# EAGLE board core (EAGLE 9.2.2), part 1 of 2
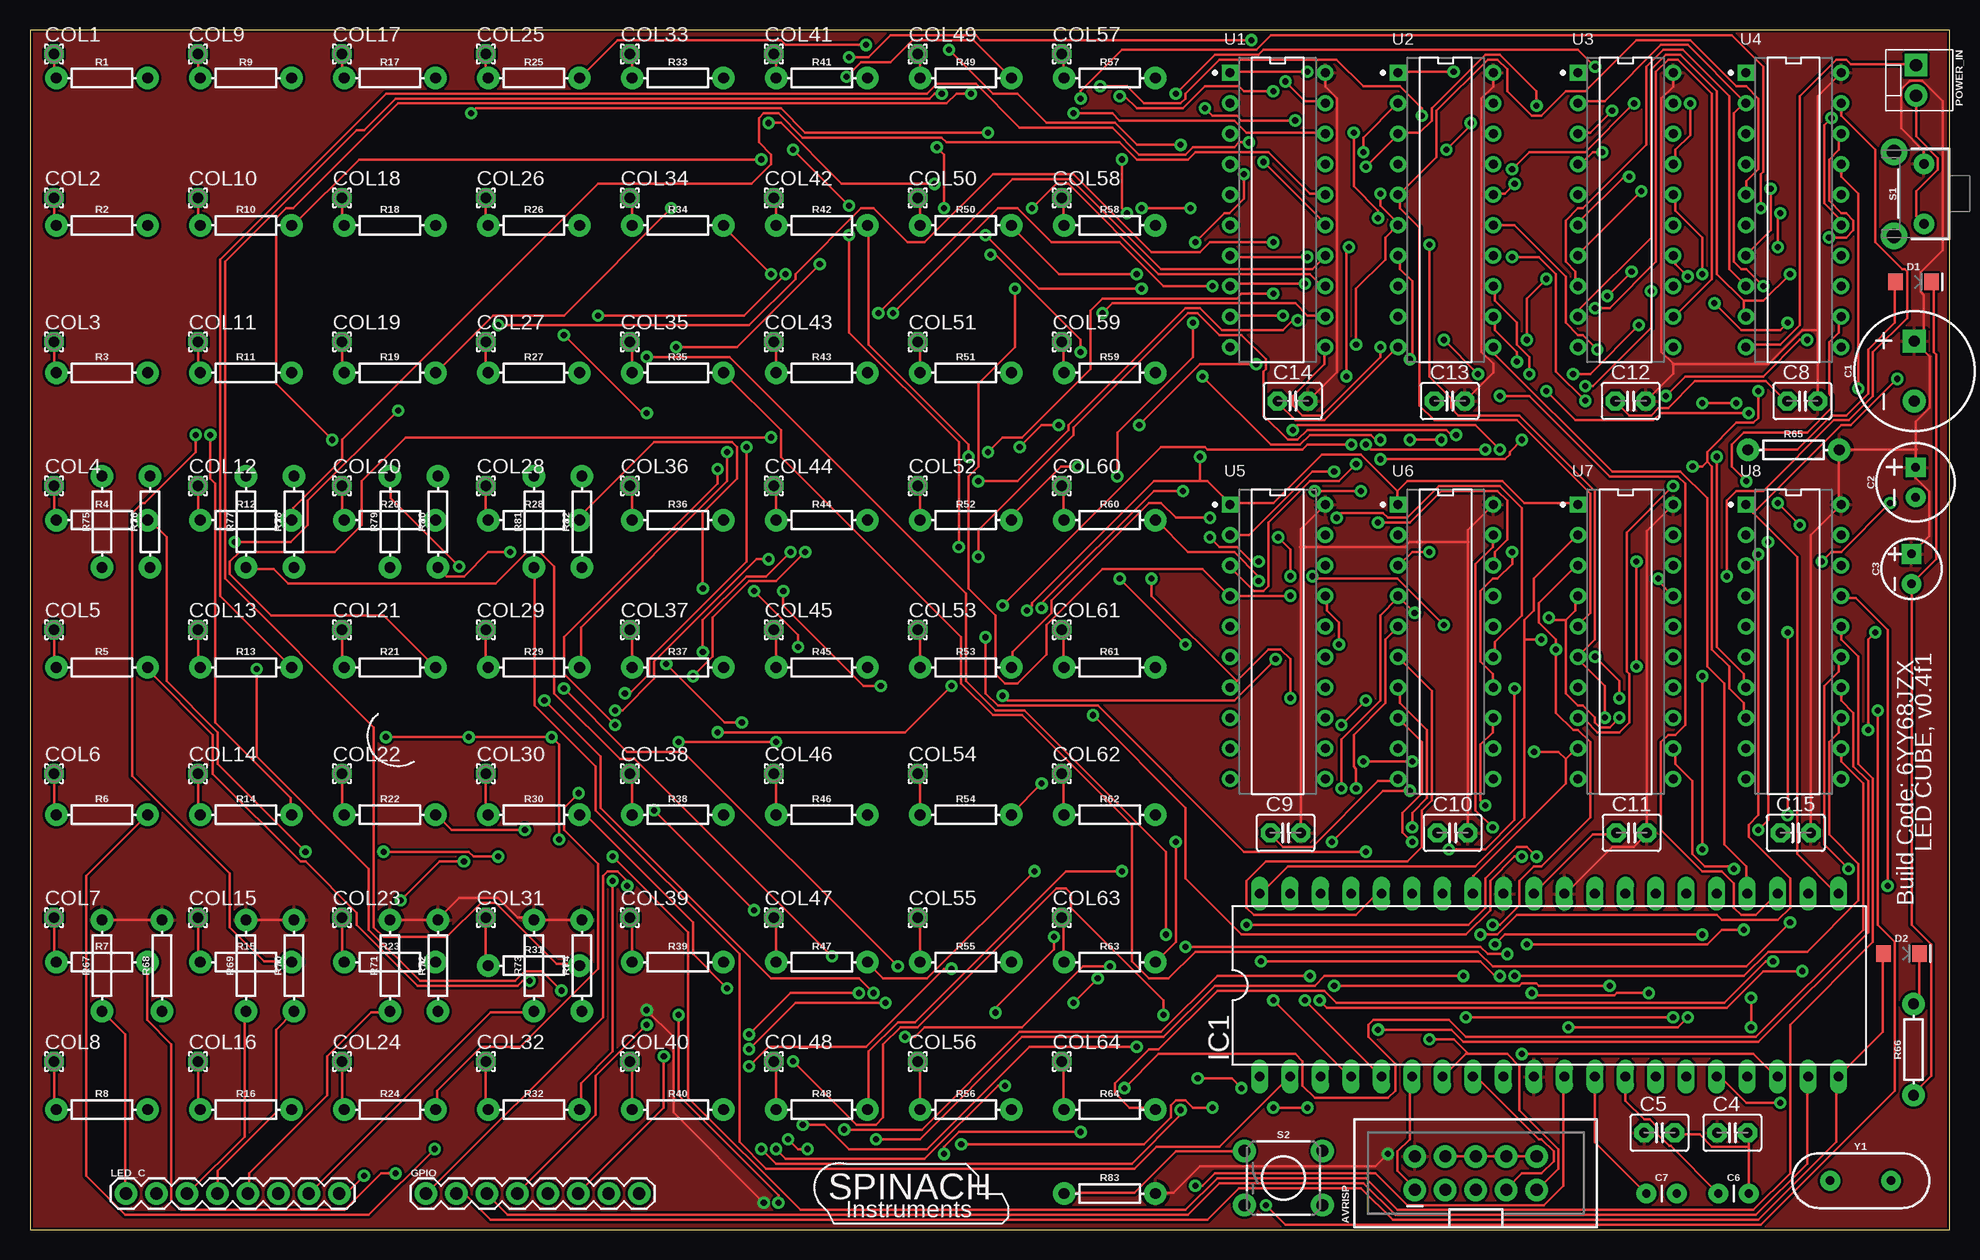
[diagram p1: board, top side]
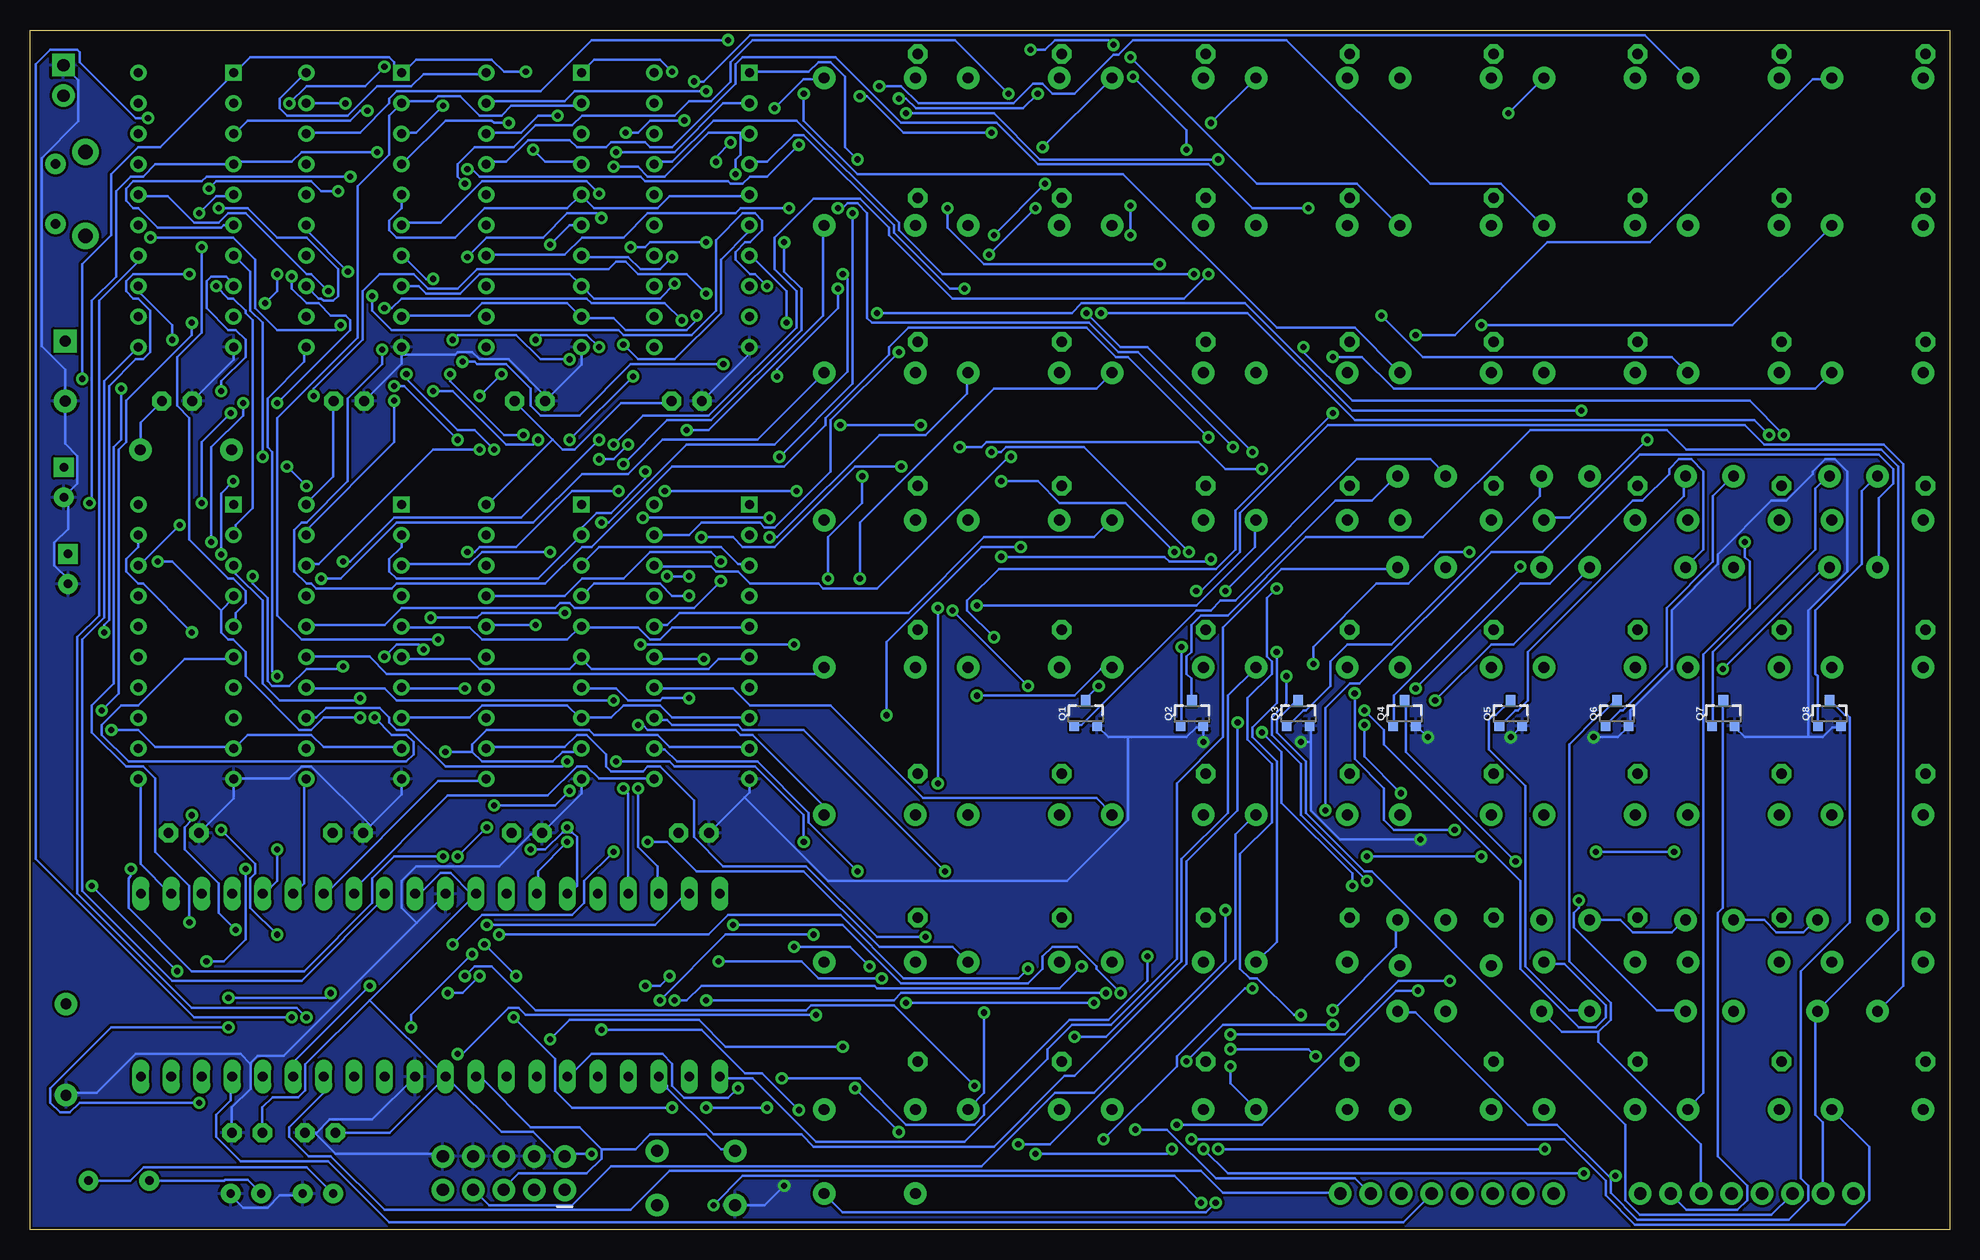
[diagram p2: board, bottom side, seen from below]

Size 160 x 100 mm. Coordinates in mm from the lower left corner, seen from the top.
Outline: 0,0 160,0 160,100 0,100 0,0
Copper layers (1*16): Top 0.035mm / dielectric 1.5mm / Bottom 0.035mm
Design rules "SparkFun": minimum track width 8mil, minimum drill 20mil, track to track 8mil, track to pad 8mil, pad to pad 8mil, via to via 8mil, smd to smd 8mil, copper to edge 8mil, drill to drill 8mil, minimum pad ring 12mil, minimum via ring 10mil, stop-mask expansion 4mil, vias tented up to drill 20mil, thermal gap 10mil

## Footprints (pad centres in the part's own frame; a part is rotated, then mirrored left to right if it is on the bottom)
2X5-SHROUDED_LOCK = drill 1.016 pad 1.88: 1 -1.397,5.08; 2 1.397,5.08; 3 -1.397,2.54; 4 1.397,2.54; 5 -1.397,0; 6 1.397,0; 7 -1.397,-2.54; 8 1.397,-2.54; 9 -1.397,-5.08; 10 1.397,-5.08
CPOL-RADIAL-5MM-10MM = drill 0.9 pad 1.93 square: + 2.5,0 | drill 0.9 pad 1.93: - -2.5,0
CPOL-RADIAL-2.5MM-6.5MM = drill 0.7 pad 1.651 square: 1 1.25,0 | drill 0.7 pad 1.651: 2 -1.25,0
CPOL-RADIAL-2.5MM-5MM = drill 0.7 pad 1.651 square: 1 1.25,0 | drill 0.7 pad 1.651: 2 -1.25,0
C2.5-3 = drill 0.813 pad 1.6 octagon: 1 -1.27,0; 2 1.27,0
CAP-PTH-2.54 = drill 0.7 pad 1.651: 1 -1.27,0; 2 1.27,0
1,6/0,9 = drill 0.914 pad 1.6 octagon: 1 0,0
LED-1206 = smd 1.2 x 1.4: A -1.5,0; C 1.5,0
1X08 = drill 1.016 pad 1.88: 1 0,0; 2 2.54,0; 3 5.08,0; 4 7.62,0; 5 10.16,0; 6 12.7,0; 7 15.24,0; 8 17.78,0
DIL40 = drill 0.813 long: 1 -24.13,-7.62; 2 -21.59,-7.62; 3 -19.05,-7.62; 4 -16.51,-7.62; 5 -13.97,-7.62; 6 -11.43,-7.62; 7 -8.89,-7.62; 8 -6.35,-7.62; 9 -3.81,-7.62; 10 -1.27,-7.62; 11 1.27,-7.62; 12 3.81,-7.62; 13 6.35,-7.62; 14 8.89,-7.62; 15 11.43,-7.62; 16 13.97,-7.62; 17 16.51,-7.62; 18 19.05,-7.62; 19 21.59,-7.62; 20 24.13,-7.62; 21 24.13,7.62; 22 21.59,7.62; 23 19.05,7.62; 24 16.51,7.62; 25 13.97,7.62; 26 11.43,7.62; 27 8.89,7.62; 28 6.35,7.62; 29 3.81,7.62; 30 1.27,7.62; 31 -1.27,7.62; 32 -3.81,7.62; 33 -6.35,7.62; 34 -8.89,7.62; 35 -11.43,7.62; 36 -13.97,7.62; 37 -16.51,7.62; 38 -19.05,7.62; 39 -21.59,7.62; 40 -24.13,7.62
MOLEX-1X2 = drill 1.016 pad 1.88 square: 1 0,0 | drill 1.016 pad 1.88: 2 2.54,0
SOT23-3 = smd 0.8 x 0.9: 1 -0.95,-1; 2 0.95,-1; 3 0,1.1
AXIAL-0.3 = drill 0.9 pad 1.88: P$1 -3.81,0; P$2 3.81,0
TACTILE_SWITCH_PTH_RIGHT_ANGLE_KIT = drill 0.8 pad 1.7: 1 -2.5,0; 2 2.5,0 | drill 1.2 pad 2.2: ANCHOR1 -3.5,2.5; ANCHOR2 3.5,2.5
TACTILE_SWITCH_PTH_6.0MM = drill 1.016 pad 1.88: 1 -3.251,2.261; 2 3.251,2.261; 3 -3.251,-2.261; 4 3.251,-2.261
TEXAS_INSTRUMENTS_SN74HC574N_0 = drill 0.75 pad 1.25 square: 1 -3.97,11.43 | drill 0.75 pad 1.25: 2 -3.97,8.89; 3 -3.97,6.35; 4 -3.97,3.81; 5 -3.97,1.27; 6 -3.97,-1.27; 7 -3.97,-3.81; 8 -3.97,-6.35; 9 -3.97,-8.89; 10 -3.97,-11.43; 11 3.97,-11.43; 12 3.97,-8.89; 13 3.97,-6.35; 14 3.97,-3.81; 15 3.97,-1.27; 16 3.97,1.27; 17 3.97,3.81; 18 3.97,6.35; 19 3.97,8.89; 20 3.97,11.43
HC49US = drill 0.7 pad 1.651: 1 -2.54,0; 2 2.54,0

## Placement (x,y rotation side)
AVRISP  AVR_SPI_PROG_5X2LOCK  [2X5-SHROUDED_LOCK]  120.51,4.7 90 top
C1  1mF  [CPOL-RADIAL-5MM-10MM]  157.07,71.56 90 top
C2  100uF  [CPOL-RADIAL-2.5MM-6.5MM]  157.18,62.29 90 top
C3  10uF  [CPOL-RADIAL-2.5MM-5MM]  156.83,55.07 90 top
C4  1uF  [C2.5-3]  141.9,8.07 0 top
C5  1uF  [C2.5-3]  135.82,8.07 0 top
C6  22pF  [CAP-PTH-2.54]  142,3 0 top
C7  22pF  [CAP-PTH-2.54]  136,3 0 top
C8  1uF  [C2.5-3]  147.74,69.07 0 top
C9  1uF  [C2.5-3]  104.66,33.07 0 top
C10  1uF  [C2.5-3]  118.58,33.07 0 top
C11  1uF  [C2.5-3]  133.5,33.07 0 top
C12  1uF  [C2.5-3]  133.42,69.07 0 top
C13  1uF  [C2.5-3]  118.34,69.07 0 top
C14  1uF  [C2.5-3]  105.26,69.07 0 top
C15  1uF  [C2.5-3]  147.18,33.07 0 top
COL1  [1,6/0,9]  2,98 0 top
COL2  [1,6/0,9]  2,86 0 top
COL3  [1,6/0,9]  2,74 0 top
COL4  [1,6/0,9]  2,62 0 top
COL5  [1,6/0,9]  2,50 0 top
COL6  [1,6/0,9]  2,38 0 top
COL7  [1,6/0,9]  2,26 0 top
COL8  [1,6/0,9]  2,14 0 top
COL9  [1,6/0,9]  14,98 0 top
COL10  [1,6/0,9]  14,86 0 top
COL11  [1,6/0,9]  14,74 0 top
COL12  [1,6/0,9]  14,62 0 top
COL13  [1,6/0,9]  14,50 0 top
COL14  [1,6/0,9]  14,38 0 top
COL15  [1,6/0,9]  14,26 0 top
COL16  [1,6/0,9]  14,14 0 top
COL17  [1,6/0,9]  26,98 0 top
COL18  [1,6/0,9]  26,86 0 top
COL19  [1,6/0,9]  26,74 0 top
COL20  [1,6/0,9]  26,62 0 top
COL21  [1,6/0,9]  26,50 0 top
COL22  [1,6/0,9]  26,38 0 top
COL23  [1,6/0,9]  26,26 0 top
COL24  [1,6/0,9]  26,14 0 top
COL25  [1,6/0,9]  38,98 0 top
COL26  [1,6/0,9]  38,86 0 top
COL27  [1,6/0,9]  38,74 0 top
COL28  [1,6/0,9]  38,62 0 top
COL29  [1,6/0,9]  38,50 0 top
COL30  [1,6/0,9]  38,38 0 top
COL31  [1,6/0,9]  38,26 0 top
COL32  [1,6/0,9]  38,14 0 top
COL33  [1,6/0,9]  50,98 0 top
COL34  [1,6/0,9]  50,86 0 top
COL35  [1,6/0,9]  50,74 0 top
COL36  [1,6/0,9]  50,62 0 top
COL37  [1,6/0,9]  50,50 0 top
COL38  [1,6/0,9]  50,38 0 top
COL39  [1,6/0,9]  50,26 0 top
COL40  [1,6/0,9]  50,14 0 top
COL41  [1,6/0,9]  62,98 0 top
COL42  [1,6/0,9]  62,86 0 top
COL43  [1,6/0,9]  62,74 0 top
COL44  [1,6/0,9]  62,62 0 top
COL45  [1,6/0,9]  62,50 0 top
COL46  [1,6/0,9]  62,38 0 top
COL47  [1,6/0,9]  62,26 0 top
COL48  [1,6/0,9]  62,14 0 top
COL49  [1,6/0,9]  74,98 0 top
COL50  [1,6/0,9]  74,86 0 top
COL51  [1,6/0,9]  74,74 0 top
COL52  [1,6/0,9]  74,62 0 top
COL53  [1,6/0,9]  74,50 0 top
COL54  [1,6/0,9]  74,38 0 top
COL55  [1,6/0,9]  74,26 0 top
COL56  [1,6/0,9]  74,14 0 top
COL57  [1,6/0,9]  86,98 0 top
COL58  [1,6/0,9]  86,86 0 top
COL59  [1,6/0,9]  86,74 0 top
COL60  [1,6/0,9]  86,62 0 top
COL61  [1,6/0,9]  86,50 0 top
COL62  [1,6/0,9]  86,38 0 top
COL63  [1,6/0,9]  86,26 0 top
COL64  [1,6/0,9]  86,14 0 top
D1  Yellow  [LED-1206]  157,79 0 top
D2  Yellow  [LED-1206]  156,23 0 top
GPIO  [1X08]  33,3 0 top
IC1  MEGA32-P  [DIL40]  126.63,20.37 0 top
LED_C  [1X08]  8,3 0 top
POWER_IN  [MOLEX-1X2]  157.21,97.07 270 top
Q1  1.2A/40V  [SOT23-3]  72,43 0 bottom
Q2  1.2A/40V  [SOT23-3]  63.14,43 0 bottom
Q3  1.2A/40V  [SOT23-3]  54.29,43 0 bottom
Q4  1.2A/40V  [SOT23-3]  45.43,43 0 bottom
Q5  1.2A/40V  [SOT23-3]  36.57,43 0 bottom
Q6  1.2A/40V  [SOT23-3]  27.71,43 0 bottom
Q7  1.2A/40V  [SOT23-3]  18.86,43 0 bottom
Q8  1.2A/40V  [SOT23-3]  10,43 0 bottom
R1  100  [AXIAL-0.3]  6,96 0 top
R2  100  [AXIAL-0.3]  6,83.71 0 top
R3  100  [AXIAL-0.3]  6,71.43 0 top
R4  100  [AXIAL-0.3]  6,59.14 0 top
R5  100  [AXIAL-0.3]  6,46.86 0 top
R6  100  [AXIAL-0.3]  6,34.57 0 top
R7  100  [AXIAL-0.3]  6,22.29 0 top
R8  100  [AXIAL-0.3]  6,10 0 top
R9  100  [AXIAL-0.3]  18,96 0 top
R10  100  [AXIAL-0.3]  18,83.71 0 top
R11  100  [AXIAL-0.3]  18,71.43 0 top
R12  100  [AXIAL-0.3]  18,59.14 0 top
R13  100  [AXIAL-0.3]  18,46.86 0 top
R14  100  [AXIAL-0.3]  18,34.57 0 top
R15  100  [AXIAL-0.3]  18,22.29 0 top
R16  100  [AXIAL-0.3]  18,10 0 top
R17  100  [AXIAL-0.3]  30,96 0 top
R18  100  [AXIAL-0.3]  30,83.71 0 top
R19  100  [AXIAL-0.3]  30,71.43 0 top
R20  100  [AXIAL-0.3]  30,59.14 0 top
R21  100  [AXIAL-0.3]  30,46.86 0 top
R22  100  [AXIAL-0.3]  30,34.57 0 top
R23  100  [AXIAL-0.3]  30,22.29 0 top
R24  100  [AXIAL-0.3]  30,10 0 top
R25  100  [AXIAL-0.3]  42,96 0 top
R26  100  [AXIAL-0.3]  42,83.71 0 top
R27  100  [AXIAL-0.3]  42,71.43 0 top
R28  100  [AXIAL-0.3]  42,59.14 0 top
R29  100  [AXIAL-0.3]  42,46.86 0 top
R30  100  [AXIAL-0.3]  42,34.57 0 top
R31  100  [AXIAL-0.3]  42,22 0 top
R32  100  [AXIAL-0.3]  42,10 0 top
R33  100  [AXIAL-0.3]  54,96 0 top
R34  100  [AXIAL-0.3]  54,83.71 0 top
R35  100  [AXIAL-0.3]  54,71.43 0 top
R36  100  [AXIAL-0.3]  54,59.14 0 top
R37  100  [AXIAL-0.3]  54,46.86 0 top
R38  100  [AXIAL-0.3]  54,34.57 0 top
R39  100  [AXIAL-0.3]  54,22.29 0 top
R40  100  [AXIAL-0.3]  54,10 0 top
R41  100  [AXIAL-0.3]  66,96 0 top
R42  100  [AXIAL-0.3]  66,83.71 0 top
R43  100  [AXIAL-0.3]  66,71.43 0 top
R44  100  [AXIAL-0.3]  66,59.14 0 top
R45  100  [AXIAL-0.3]  66,46.86 0 top
R46  100  [AXIAL-0.3]  66,34.57 0 top
R47  100  [AXIAL-0.3]  66,22.29 0 top
R48  100  [AXIAL-0.3]  66,10 0 top
R49  100  [AXIAL-0.3]  78,96 0 top
R50  100  [AXIAL-0.3]  78,83.71 0 top
R51  100  [AXIAL-0.3]  78,71.43 0 top
R52  100  [AXIAL-0.3]  78,59.14 0 top
R53  100  [AXIAL-0.3]  78,46.86 0 top
R54  100  [AXIAL-0.3]  78,34.57 0 top
R55  100  [AXIAL-0.3]  78,22.29 0 top
R56  100  [AXIAL-0.3]  78,10 0 top
R57  100  [AXIAL-0.3]  90,96 0 top
R58  100  [AXIAL-0.3]  90,83.71 0 top
R59  100  [AXIAL-0.3]  90,71.43 0 top
R60  100  [AXIAL-0.3]  90,59.14 0 top
R61  100  [AXIAL-0.3]  90,46.86 0 top
R62  100  [AXIAL-0.3]  90,34.57 0 top
R63  100  [AXIAL-0.3]  90,22.29 0 top
R64  100  [AXIAL-0.3]  90,10 0 top
R65  100  [AXIAL-0.3]  147,65 0 top
R66  100  [AXIAL-0.3]  157,15 90 top
R67  4.7k  [AXIAL-0.3]  6,22 90 top
R68  4.7k  [AXIAL-0.3]  11,22 90 top
R69  4.7k  [AXIAL-0.3]  18,22 90 top
R70  4.7k  [AXIAL-0.3]  22,22 90 top
R71  4.7k  [AXIAL-0.3]  30,22 90 top
R72  4.7k  [AXIAL-0.3]  34,22 90 top
R73  4.7k  [AXIAL-0.3]  42,22 90 top
R74  4.7k  [AXIAL-0.3]  46,22 90 top
R75  4.7k  [AXIAL-0.3]  6,59 90 top
R76  4.7k  [AXIAL-0.3]  10,59 90 top
R77  4.7k  [AXIAL-0.3]  18,59 90 top
R78  4.7k  [AXIAL-0.3]  22,59 90 top
R79  4.7k  [AXIAL-0.3]  30,59 90 top
R80  4.7k  [AXIAL-0.3]  34,59 90 top
R81  4.7k  [AXIAL-0.3]  42,59 90 top
R82  4.7k  [AXIAL-0.3]  46,59 90 top
R83  4.7k  [AXIAL-0.3]  90,3 0 top
S1  MOMENTARY-SWITCH-SPST-PTH-RIGHT-ANGLE-KIT  [TACTILE_SWITCH_PTH_RIGHT_ANGLE_KIT]  157.87,86.34 90 top
S2  MOMENTARY-SWITCH-SPST-PTH-6.0MM  [TACTILE_SWITCH_PTH_6.0MM]  104.48,4.29 0 top
U1  TEXAS_INSTRUMENTS_SN74HC574NTEXAS_INSTRUMENTS_SN74HC574N_0_0  [TEXAS_INSTRUMENTS_SN74HC574N_0]  104,85 0 top
U2  TEXAS_INSTRUMENTS_SN74HC574NTEXAS_INSTRUMENTS_SN74HC574N_0_0  [TEXAS_INSTRUMENTS_SN74HC574N_0]  118,85 0 top
U3  TEXAS_INSTRUMENTS_SN74HC574NTEXAS_INSTRUMENTS_SN74HC574N_0_0  [TEXAS_INSTRUMENTS_SN74HC574N_0]  133,85 0 top
U4  TEXAS_INSTRUMENTS_SN74HC574NTEXAS_INSTRUMENTS_SN74HC574N_0_0  [TEXAS_INSTRUMENTS_SN74HC574N_0]  147,85 0 top
U5  TEXAS_INSTRUMENTS_SN74HC574NTEXAS_INSTRUMENTS_SN74HC574N_0_0  [TEXAS_INSTRUMENTS_SN74HC574N_0]  104,49 0 top
U6  TEXAS_INSTRUMENTS_SN74HC574NTEXAS_INSTRUMENTS_SN74HC574N_0_0  [TEXAS_INSTRUMENTS_SN74HC574N_0]  118,49 0 top
U7  TEXAS_INSTRUMENTS_SN74HC574NTEXAS_INSTRUMENTS_SN74HC574N_0_0  [TEXAS_INSTRUMENTS_SN74HC574N_0]  133,49 0 top
U8  TEXAS_INSTRUMENTS_SN74HC574NTEXAS_INSTRUMENTS_SN74HC574N_0_0  [TEXAS_INSTRUMENTS_SN74HC574N_0]  147,49 0 top
Y1  16MHz  [HC49US]  152.59,4.07 0 top

## Tracks (layer width: path | path; a pad name or v marks a point on that pad's centre or on a via)
CLK1
  Bottom 0.203: U4.11 150.98,73.56 153.82,70.71 153.82,51 155.65,49.17 155.65,28.25 148.13,20.73 137.36,20.73 130.25,27.84 IC1.29
CLK2
  Bottom 0.203: U5.11 108.1,37.59 112.57,37.59 113.59,38.61 114.4,38.61 116.84,36.17 125.17,36.17 132.89,28.45 132.89,28.04 IC1.28
CLK3
  Bottom 0.203: U6.11 122.12,37.39 125.98,37.39 135.33,28.04 IC1.27
CLK4
  Bottom 0.203: U7.11 137.16,37.39 137.16,28.85 137.97,28.04 IC1.26
CLK5  (via drill 0.51)
  Top 0.203: v139.4,31.7 v139.4,46.13
  Bottom 0.203: v139.4,46.13 139.8,46.53 139.8,64.82 140.21,65.23 140.21,69.29 137.16,72.34 137.16,73.56 U3.11 | v139.4,31.7 139.4,29.06 140.41,28.04 IC1.25
CLK6
  Top 0.203: U2.11 122.12,73.56 122.12,72.95 131.88,63.2 137.57,63.2 139.8,60.96 139.8,46.94 141.22,45.52 141.22,32.11 143.05,30.28 143.05,28.04 IC1.24
CLK7  (via drill 0.51)
  Top 0.203: v112.57,73.56 112.57,72.75 107.7,67.87 106.07,67.87 105.26,68.68 105.26,69.49 107.9,72.14 107.9,73.56 U1.11 | v120.7,71.32 v117.86,74.17 | v122.53,69.49 124.97,69.49 131.67,62.79 137.36,62.79 137.97,62.18 137.97,42.06 137.16,41.25 136.55,41.25 135.94,40.64 135.94,33.33 139.4,29.87 141.02,29.87 142.04,28.85 142.04,26.82 142.65,26.21 143.87,26.21 145.49,27.84 IC1.23
  Bottom 0.203: v112.57,73.56 113.59,74.57 117.45,74.57 v117.86,74.17 | v122.53,69.49 v120.7,71.32
CLK8
  Bottom 0.203: U8.11 150.77,37.39 150.77,30.48 148.34,28.04 IC1.22
D0  (via drill 0.51)
  Top 0.203: v108.71,63.2 106.88,63.2 101.6,57.91 100.18,57.91 U5.2 | 124.56,49.17 124.56,50.8 125.37,51.61 125.37,54.25 128.83,57.71 U7.2 | 124.56,49.17 124.56,34.34 120.5,30.28 104.85,30.28 102.62,28.04 IC1.40 | v111.15,89.81 111.15,91.03 114,93.88 U2.2 | v144.47,78.64 143.05,80.06 142.65,80.06 142.04,80.67 142.04,93.07 142.85,93.88 U4.2 142.85,94.08 138.18,98.75 135.94,98.75 131.27,94.08 129.03,94.08 U3.2 | v125.98,49.17 124.56,49.17
  Bottom 0.203: v108.71,63.2 108.71,62.59 111.56,59.74 112.78,59.74 114,58.52 114,57.91 U6.2 114.2,57.71 117.65,54.25 129.44,54.25 130.05,54.86 130.05,55.88 129.03,56.9 129.03,57.71 U7.2 | v111.15,89.81 106.27,89.81 102.21,93.88 100.18,93.88 U1.2 | U2.2 114.2,93.88 114.4,93.67 119.89,93.67 120.7,92.86 122.53,92.86 124.16,94.49 125.98,94.49 126.39,94.08 128.83,94.08 U3.2 129.03,93.88 130.05,92.86 130.05,89.61 132.69,86.97 132.69,74.37 139.4,67.67 139.4,51.21 137.36,49.17 v125.98,49.17 | v144.47,78.64 143.46,77.62 143.05,77.62 142.04,76.61 142.04,76.4 141.43,75.79 141.43,60.15 142.85,58.73 142.85,57.91 U8.2
D1  (via drill 0.51)
  Top 0.203: v131.88,93.27 130.05,91.44 129.03,91.44 U3.3 | v111.35,88.59 114,91.24 U2.3 114.2,91.44 115.82,91.44 116.84,92.46 116.84,93.47 121.31,97.94 122.53,97.94 125.58,94.89 v125.58,93.67 | v116.64,56.49 115.21,56.49 114.2,55.47 U6.3 | v132.49,44.3 132.49,45.72 v130.45,47.75 | U7.3 128.83,55.27 125.78,52.22 125.78,50.6 127.2,49.17 v127.2,48.36 127.2,43.08 128.63,41.66 129.03,41.66 130.05,40.64 130.05,34.34 125.98,30.28 125.37,30.28 124.16,29.06 124.16,27.03 122.53,25.4 v121.92,25.4 | v101.19,87.99 101.19,85.95 99.97,84.73 99.57,84.73 v97.13,82.3 | v110.54,63.8 109.12,62.38 106.68,62.38 103.23,58.93 103.23,53.65 102.82,53.24 102.01,53.24 99.97,55.27 U5.3
  Bottom 0.203: v131.88,93.27 132.49,93.27 133.3,92.46 141.83,92.46 142.85,91.44 U4.3 | 100.79,91.44 103.43,91.44 107.09,87.78 108.51,87.78 109.32,88.59 v111.35,88.59 | 100.79,91.44 100.18,91.44 U1.3 | v125.58,93.67 127.81,91.44 128.83,91.44 U3.3 | U5.3 100.18,55.47 100.99,55.47 102.41,56.9 112.57,56.9 114,55.47 U6.3 | v116.64,56.49 122.33,56.49 123.34,55.47 128.83,55.47 U7.3 | v132.49,44.3 132.69,44.09 139.19,44.09 140.61,45.52 140.61,52.43 142.85,54.66 142.85,55.27 U8.3 | v130.45,47.75 129.44,48.77 127.61,48.77 v127.2,48.36 | v121.92,25.4 107.9,25.4 105.46,27.84 105.05,27.84 IC1.39 | 100.79,91.44 100.79,89.61 101.19,89.2 v101.19,87.99 | v97.13,82.3 97.13,79.86 95.71,78.44 95.71,74.98 103.23,67.46 106.88,67.46 v110.54,63.8
D2  (via drill 0.51)
  Top 0.203: v118.06,90.02 120.09,92.05 v120.09,92.25 | v131.06,89.81 130.25,89.81 129.44,89 129.03,89 U3.4 | 128.02,50.8 128.83,51.61 128.83,52.63 U7.4 | 128.02,50.8 128.02,44.7 129.03,43.69 129.44,43.69 130.45,42.67 130.45,42.27 130.86,41.86 131.67,41.86 v132.49,42.67 | v105.05,52.83 100.18,52.83 U5.4 99.97,52.83 97.74,55.07 89.41,55.07 84.73,50.39 84.73,47.95 82.3,45.52 81.28,45.52 80.47,46.33 80.47,51.21 78.23,53.44 78.23,62.79 79.05,63.6 79.05,70.51 82.09,73.56 v82.09,78.44 | v109.32,36.78 109.32,40.84 112.57,44.09 112.57,51.21 114,52.63 U6.4 114.2,52.63 v115.42,51.41 | 128.02,50.8 126.8,50.8 v126.59,51 | v155.04,60.55 150.98,56.49 150.16,56.49 v149.35,55.68
  Bottom 0.203: v118.06,90.02 117.04,89 114.2,89 U2.4 | v120.09,92.25 121.31,92.25 121.51,92.46 125.37,92.46 128.83,89 U3.4 | v131.06,89.81 137.36,89.81 138.18,89 142.85,89 U4.4 143.05,88.8 149.56,88.8 150.57,87.78 151.59,87.78 152.81,86.56 152.81,79.45 154.84,77.42 154.84,60.76 v155.04,60.55 | v132.49,42.67 135.53,42.67 136.55,41.66 137.57,41.66 142.04,46.13 142.04,48.16 143.05,49.17 143.46,49.17 144.07,49.78 144.07,51.61 | 144.07,51.61 143.05,52.63 U8.4 | v105.05,52.83 106.48,52.83 107.49,53.85 112.98,53.85 114,52.83 U6.4 | v82.09,78.44 83.31,78.44 87.99,83.11 87.99,83.72 95.5,91.24 96.32,91.24 98.55,89 99.97,89 U1.4 | v109.32,36.78 109.32,31.9 107.7,30.28 107.7,28.04 IC1.38 | v126.59,51 122.73,51 122.33,51.41 v115.42,51.41 | v149.35,55.68 148.13,55.68 144.07,51.61
D3  (via drill 0.51)
  Top 0.203: v145.69,81.89 145.69,84.53 v145.9,84.73 | v110.54,36.78 110.54,38.41 110.34,38.61 110.34,41.25 112.98,43.89 112.98,49.17 114,50.19 U6.5 | U7.5 129.03,50.39 130.05,51.41 130.05,61.37 123.95,67.46 117.04,67.46 115.82,68.68 115.82,83.52 114.2,85.14 114.2,86.16 U2.5 114.2,86.36 117.25,89.41 117.25,93.27 121.51,97.54 122.33,97.54 123.14,96.72 123.14,94.89 125.17,92.86 125.98,92.86 128.02,94.89 129.64,94.89 133.91,99.16 138.38,99.16 142.24,95.3 143.05,95.3 144.07,94.28 144.07,88.39 143.05,87.38 143.05,86.36 U4.5
  Bottom 0.203: v145.69,81.89 145.69,74.78 147.73,72.75 147.73,68.68 146.71,67.67 146.71,57.51 143.46,54.25 143.05,54.25 142.04,53.24 142.04,52.22 142.85,51.41 142.85,50.39 U8.5 | v145.9,84.73 144.47,86.16 143.05,86.16 U4.5 | U1.5 100.18,86.16 106.68,86.16 107.7,85.14 112.98,85.14 114,86.16 U2.5 114.2,86.16 115.21,85.14 122.12,85.14 124.56,82.7 129.44,82.7 130.05,83.31 130.05,84.12 129.03,85.14 129.03,86.16 U3.5 | U5.5 100.18,50.19 106.48,50.19 107.49,49.17 108.31,49.17 109.32,50.19 114,50.19 U6.5 114.2,50.19 115.21,49.17 122.33,49.17 123.34,50.19 128.83,50.19 U7.5 | v110.54,36.78 110.13,36.37 110.13,28.04 IC1.37
D4  (via drill 0.51)
  Top 0.203: v110.54,73.76 110.54,78.44 112.98,80.87 112.98,82.7 114,83.72 U2.6 114,83.92 112.57,85.34 v112.57,86.36 | v133.3,87.78 132.89,87.78 129.03,83.92 U3.6 | v131.27,42.67 131.27,45.31 129.03,47.55 U7.6 129.03,47.75 130.45,49.17 130.45,61.57 124.16,67.87 119.08,67.87 118.47,68.48 118.47,69.29 116.64,71.12 v116.64,82.09 | IC1.36 112.57,27.84 112.17,27.84 110.54,26.21 102.01,26.21 101.4,26.82 101.4,29.06 103.02,30.68 114.81,30.68 116.03,31.9 116.03,34.95 116.84,35.76 116.84,44.91 114.2,47.55 U6.6
  Bottom 0.203: v110.54,73.76 109.32,72.54 106.27,72.54 102.41,76.4 102.41,80.87 100.18,83.11 100.18,83.72 U1.6 | v112.57,86.36 113.59,87.38 122.33,87.38 125.78,83.92 128.83,83.92 U3.6 | v133.3,87.78 145.29,87.78 145.69,87.38 151.38,87.38 151.99,86.77 151.99,85.75 151.38,85.14 150.98,85.14 149.35,83.52 144.07,83.52 143.87,83.72 143.05,83.72 U4.6 | U5.6 100.18,47.55 102.62,47.55 103.43,46.74 113.18,46.74 114,47.55 U6.6 114.2,47.55 115.01,46.74 122.53,46.74 123.34,47.55 128.83,47.55 U7.6 | v131.27,42.67 129.84,41.25 128.63,41.25 128.02,40.64 128.02,39.62 128.63,39.01 151.79,39.01 154.03,41.25 154.03,42.06 152.4,43.69 150.98,43.69 147.12,47.55 143.05,47.55 U8.6 | v116.64,82.09 115.01,83.72 114.2,83.72 U2.6
D5  (via drill 0.51)
  Top 0.203: 100.58,45.72 103.23,48.36 104.24,48.36 105.05,47.55 v105.05,44.3 | 100.58,45.72 100.18,45.31 U5.7 | v123.75,45.11 123.75,34.14 121.31,31.7 v118.26,31.7 | v115.21,33.53 115.21,34.75 116.43,35.97 116.43,41.66 114.2,43.89 114.2,45.11 U6.7 | v106.48,81.08 100.18,81.08 U1.7 | v140.61,64.41 140.61,48.56 142.85,46.33 142.85,45.31 U8.7 | v134.31,86.56 129.03,81.28 U3.7 | v145.09,86.77 145.09,83.31 143.05,81.28 U4.7 | v115.01,72.54 115.21,72.75 115.21,79.05 114.2,80.06 114.2,81.08 U2.7 | v124.77,74.17 124.77,77.62 v126.39,79.25 | 100.58,45.72 93.47,52.83 v93.47,54.25 | v90.63,62.79 90.63,66.45 96.93,72.75 v96.93,75.59
  Bottom 0.203: v105.05,44.3 107.29,44.3 107.49,44.09 110.13,44.09 111.15,45.11 114,45.11 U6.7 | v123.75,45.11 128.83,45.11 U7.7 | v118.26,31.7 117.04,31.7 115.62,33.12 115.21,33.12 | 115.21,33.12 114.81,33.12 114.4,32.72 114.4,28.65 115.01,28.04 IC1.35 | 115.21,33.12 v115.21,33.53 | v106.48,81.08 107.49,80.06 109.12,80.06 110.13,81.08 114,81.08 U2.7 | v140.61,64.41 140.61,75.59 141.63,76.61 141.63,79.86 142.85,81.08 U4.7 | v134.31,86.56 135.74,86.56 136.55,87.38 144.47,87.38 v145.09,86.77 | v115.01,72.54 117.45,72.54 119.48,74.57 124.36,74.57 v124.77,74.17 | v126.39,79.25 127,79.25 128.83,81.08 U3.7 | v93.47,54.25 93.47,57.71 90.63,60.55 v90.63,62.79 | v96.93,75.59 96.93,78.23 99.97,81.28 U1.7
D6  (via drill 0.51)
  Top 0.203: v115.21,32.31 114.4,33.12 114.4,34.75 116.03,36.37 116.03,40.64 114.2,42.47 U6.8 | v106.27,78.84 100.18,78.84 U1.8 | 139.8,64.01 140.21,63.6 140.21,48.36 141.63,46.94 141.63,45.11 142.85,43.89 142.85,42.67 U8.8 | 139.8,64.01 139.8,64.82 142.24,67.26 143.66,67.26 144.07,67.67 v144.07,69.9 | U3.8 128.83,78.84 128.83,79.86 128.02,80.67 128.02,84.12 129.03,85.14 129.44,85.14 134.72,90.42 134.72,96.93 136.14,98.35 137.77,98.35 141.63,94.49 141.63,80.06 142.85,78.84 U4.8 | v136.96,61.98 133.1,58.12 133.1,46.53 133.3,46.33 133.3,42.27 132.49,41.45 130.66,41.45 129.64,42.47 129.03,42.47 U7.8 | v138.58,63.6 139.4,63.6 139.8,64.01
  Bottom 0.203: U5.8 100.18,42.67 106.48,42.67 107.49,43.69 110.54,43.69 111.56,42.67 114,42.67 U6.8 114.2,42.67 115.21,43.69 122.33,43.69 123.34,42.67 128.83,42.67 U7.8 | v115.21,32.31 117.65,29.87 117.65,28.04 IC1.34 | v106.27,78.84 107.49,77.62 112.98,77.62 114,78.64 U2.8 114.2,78.84 115.01,79.65 122.53,79.65 124.16,78.03 127,78.03 127.61,78.64 128.83,78.64 U3.8 | v144.07,69.9 144.07,70.71 142.04,72.75 142.04,74.17 142.85,74.98 143.46,74.98 145.29,76.81 145.29,79.05 144.88,79.45 143.66,79.45 143.05,78.84 U4.8 | v138.58,63.6 v136.96,61.98
D7  (via drill 0.51)
  Top 0.203: 128.02,39.22 128.02,37.19 120.29,29.46 120.29,28.04 IC1.33 | 128.02,39.22 128.83,40.03 U7.9 | v125.37,39.83 127.41,39.83 128.02,39.22 | v104.44,76.2 100.18,76.2 U1.9 | 142.85,77.42 142.85,76.2 U4.9 | 142.85,77.42 140.61,79.65 140.61,94.89 137.57,97.94 136.35,97.94 135.13,96.72 135.13,82.7 129.03,76.61 129.03,76.2 U3.9 | v153.21,41.66 153.21,49.17 v153.82,49.78 | v146.71,79.65 144.47,77.42 142.85,77.42
  Bottom 0.203: 123.14,39.83 123.14,40.44 121.92,41.66 113.39,41.66 112.98,41.25 107.7,41.25 106.68,40.23 100.18,40.23 U5.9 | 123.14,39.83 122.33,39.01 116.43,39.01 115.62,39.83 114.4,39.83 114.2,40.03 U6.9 | U7.9 129.03,40.23 135.53,40.23 136.55,41.25 141.83,41.25 142.85,40.23 U8.9 143.05,40.23 149.56,40.23 150.98,41.66 v153.21,41.66 | v125.37,39.83 123.14,39.83 | v104.44,76.2 104.44,75.79 105.26,74.98 110.34,74.98 111.35,76 114,76 U2.9 114.2,76.2 115.21,77.22 122.33,77.22 123.34,76.2 128.83,76.2 U3.9 | v153.82,49.78 153.82,50.39 153.42,50.8 153.42,70.31 151.18,72.54 150.57,72.54 149.96,73.15 149.96,76.61 150.98,77.62 151.38,77.62 151.99,78.23 151.99,79.05 151.38,79.65 v146.71,79.65
GND  (via drill 0.51)
  Top 0.203: D1.C 158.7,78.84 158.7,73.15 158.9,72.95 158.9,55.88 156.87,53.85 C3.2 156.87,53.65 156.87,25.4 158.5,23.77 158.5,12.8 157.07,11.38 R66.P$1 | U2.10 114,73.56 107.9,67.46 105.46,67.46 104.04,68.89 C14.1 | C8.1 146.3,69.09 144.68,70.71 138.79,70.71 136.55,68.48 135.74,68.48 135.13,67.87 133.3,67.87 132.28,68.89 C12.1 | POWER_IN.1 157.07,97.13 151.79,97.13 151.38,97.54 150.57,97.54 147.52,94.49 147.52,75.39 145.9,73.76 143.05,73.76 U4.10 | v44.09,32.51 44.09,40.44 v43.48,41.05 v36.58,41.05 v29.67,41.05 | U6.10 114,37.39 112.37,37.39 106.88,31.9 104.44,31.9 103.43,32.92 C9.1 | AVRISP.4 118.06,6.1 120.5,6.1 AVRISP.6 120.7,6.1 122.94,6.1 AVRISP.8 123.14,6.1 125.58,6.1 AVRISP.10 | v97.13,3.66 97.74,3.66 98.75,4.67 112.17,4.67 114.81,2.03 126.19,2.03 127.81,3.66 127.81,12.6 IC1.11 | 143.26,6.91 143.26,7.92 C4.2 | 143.26,6.91 143.26,3.05 C6.2 | C11.1 132.08,32.92 130.25,32.92 125.37,28.04 IC1.31 | 143.26,6.91 140.21,6.91 139.19,7.92 137.16,7.92 C5.2 | v62.18,40.64 v54.05,40.64
  Bottom 0.203: C14.1 100.03,73.03 U1.10 | U2.10 114.03,72.11 C13.1 116.84,69.29 120.09,72.54 122.53,72.54 123.14,73.15 124.36,73.15 124.56,72.95 129.03,72.95 U3.10 129.03,72.19 C12.1 | C8.1 143.03,72.51 U4.10 | C3.2 156.83,54.24 157.96,55.37 157.96,57.27 156.83,58.4 156.83,60.69 C2.2 156.05,62.17 156.05,64.49 157.07,65.51 C1.- 157.07,71.7 159.03,73.65 159.03,89.32 155.97,92.38 155.97,95.83 POWER_IN.1 | C9.1 100.44,36.02 | 100.44,36.02 100.03,36.43 U5.10 | U6.10 114.03,36.35 C10.1 117.45,32.92 118.26,32.92 120.9,30.28 127.81,30.28 129.03,29.06 129.03,26.82 127.78,25.57 | C11.1 131.62,33.68 | 131.62,33.68 129.03,36.27 U7.10 | C15.1 143.03,35.95 U8.10 142.85,37.59 138.38,37.59 137.36,38.61 136.55,38.61 131.62,33.68 | IC1.11 131.47,9.18 135.01,9.18 136.11,8.07 C5.2 136.35,8.13 134.52,6.3 125.78,6.3 AVRISP.10 | C4.2 143.17,10.18 141.62,11.73 141.62,13.88 | 141.62,13.88 141.02,14.48 138.87,14.48 127.78,25.57 | 127.78,25.57 IC1.31 | v36.58,41.05 35.76,41.86 Q5.2 | v43.48,41.05 44.3,41.86 Q4.2 | 53.24,40.64 53.24,34.95 50.8,32.51 v44.09,32.51 | 53.24,40.64 53.24,41.86 Q3.2 | 11.79,41.05 17.07,41.05 17.88,41.86 Q7.2 | 11.79,41.05 10.57,41.05 9.75,41.86 9.14,41.86 Q8.2 | 11.79,41.05 11.79,51.61 8.53,54.86 8.53,63.2 9.55,64.21 10.36,64.21 11.38,63.2 11.38,62.99 13.61,60.76 14.83,60.76 19.3,56.29 19.3,55.47 23.16,51.61 23.16,46.74 26.62,43.28 26.62,42.06 Q6.2 26.82,41.86 27.64,41.05 v29.67,41.05 | 68.48,41.05 70.1,41.05 70.92,41.86 Q1.2 | 68.48,41.05 63.6,41.05 62.79,41.86 62.38,41.86 Q2.2 62.18,41.86 v62.18,40.64 | 68.48,41.05 68.48,34.14 73.56,29.06 93.47,29.06 100.44,36.02
  Bottom 0.203: v97.13,3.66 98.75,2.03 101.19,2.03 S2.3 | C7.2 137.36,2.85 139.19,2.85 140.21,1.83 142.24,1.83 143.26,2.85 C6.2 | R66.P$1 156.87,11.38 154.43,11.38 151.18,14.63 142.44,14.63 141.63,13.82 141.62,13.88 | v54.05,40.64 53.24,40.64
  pour Bottom: 0,100 160,100 160,0 0,0
N$2
  Top 0.203: COL1.1 2.03,97.94 2.03,96.11 R1.P$1
N$3  (via drill 0.51)
  Top 0.203: v146.51,34.54 v146.51,49.78 | v142.85,24.99 141.02,24.99 139.8,23.77 v124.77,23.77 | v111.35,31.5 101.19,31.5 89,43.69 80.67,43.69 79.65,44.7 v79.65,49.38 | v51.41,68.07 51,68.07 v44.5,74.57
  Bottom 0.203: v146.51,49.78 150.57,53.85 150.98,53.85 151.99,54.86 151.99,55.88 150.98,56.9 150.98,57.71 U8.19 | v146.51,34.54 146.51,34.14 147.12,33.53 147.12,31.7 144.27,28.85 144.27,26.42 v142.85,24.99 | v124.77,23.77 122.33,26.21 114.81,26.21 113.79,27.23 113.79,29.06 v111.35,31.5 | v79.65,49.38 81.89,51.61 81.89,52.43 79.25,55.07 61.16,55.07 59.54,56.69 59.54,59.94 v51.41,68.07 | v44.5,74.57 41.25,74.57 33.53,82.3 24.99,82.3 11.38,95.91 9.96,95.91 R1.P$2
N$4
  Top 0.203: COL2.1 2.03,85.95 2.03,83.72 R2.P$1
N$5  (via drill 0.51)
  Top 0.203: v145.69,60.55 v147.52,58.73 | v143.26,68.07 135.94,68.07 135.33,67.46 128.83,67.46 v126.39,69.9 | v115.01,65.84 v117.65,65.84 | v109.73,71.12 109.73,81.69 v109.93,81.89 | v103.63,82.3 98.35,82.3 97.54,81.48 93.47,81.48 86.97,87.99 80.26,87.99 74.57,82.3 73.15,82.3 70.31,85.14 69.29,85.14 63.8,79.65 63.8,79.25 59.94,75.39 v39.01,75.39
  Bottom 0.203: v147.52,58.73 150.77,55.47 U8.18 | v145.69,60.55 145.69,65.63 v143.26,68.07 | v126.39,69.9 124.77,69.9 120.29,65.43 118.06,65.43 v117.65,65.84 | v109.73,71.12 v115.01,65.84 | v109.93,81.89 108.71,81.89 108.31,82.3 v103.63,82.3 | v39.01,75.39 18.09,75.39 9.96,83.52 R2.P$2
N$6
  Top 0.203: COL3.1 2.03,73.97 2.03,71.53 R3.P$1
N$7  (via drill 0.51)
  Top 0.203: v154.84,28.65 154.84,49.99 152.2,52.63 150.98,52.63 U8.17 | v147.73,21.54 144.47,21.54 141.43,18.49 108.1,18.49 v107.49,19.1 | v94.69,24.59 94.69,31.5 82.91,43.28 80.47,43.28 78.03,45.72 78.03,53.03 58.32,72.75 v51.41,72.75
  Bottom 0.203: v147.73,21.54 v154.84,28.65 | v107.49,19.1 102.01,24.59 v94.69,24.59 | v51.41,72.75 48.97,72.75 46.33,70.1 11.18,70.1 9.96,71.32 R3.P$2
N$8
  Top 0.203: COL4.1 2.03,61.98 2.03,59.33 R4.P$1
N$9  (via drill 0.51)
  Top 0.203: v48.56,31.09 54.86,24.79 54.86,10.97 64.21,1.63 96.32,1.63 98.96,4.27 111.35,4.27 114,1.63 143.66,1.63 146.71,4.67 146.71,17.07 153.62,23.98 153.62,37.59 152.4,38.81 152.4,47.75 150.98,49.17 150.98,50.19 U8.16 | v39.01,31.09 36.98,31.09 36.58,31.5 v29.46,31.5 | v22.96,31.5 15.65,38.81 15.65,41.45 11.38,45.72 11.38,57.71 9.96,59.13 R4.P$2
  Bottom 0.203: v39.01,31.09 v48.56,31.09 | v22.96,31.5 v29.46,31.5
N$10
  Top 0.203: COL5.1 2.03,49.99 2.03,46.94 R5.P$1
N$11  (via drill 0.51)
  Top 0.203: v151.59,30.07 149.56,32.11 149.56,45.31 150.77,46.53 150.77,47.55 U8.15 | v125.58,31.09 124.77,31.9 123.95,31.9 121.31,29.26 121.31,26.82 119.89,25.4 v101.4,25.4 | v69.09,19.71 63.4,19.71 v59.94,16.26 | v41.66,20.73 41.05,20.73 40.64,20.32 32.31,20.32 27.23,25.4 27.23,26.42 22.96,30.68 22.55,30.68 15.24,38 15.24,41.25 9.75,46.74 R5.P$2
  Bottom 0.203: v151.59,30.07 151.59,29.46 151.79,29.26 151.79,26.82 146.51,21.54 137.16,21.54 131.47,27.23 131.47,29.26 129.64,31.09 v125.58,31.09 | v101.4,25.4 92.25,25.4 87.38,20.52 76.81,20.52 75.59,21.74 75.59,22.76 74.78,23.57 72.75,23.57 71.12,21.95 71.12,21.74 v69.09,19.71 | v59.94,16.26 50.39,16.26 45.92,20.73 v41.66,20.73
N$12
  Top 0.203: COL6.1 2.03,38 2.03,34.75 R6.P$1
N$13  (via drill 0.51)
  Top 0.203: v112.37,16.66 118.47,16.66 119.48,15.65 144.07,15.65 153.21,24.79 153.21,37.39 151.99,38.61 151.99,43.08 150.98,44.09 150.98,45.11 U8.14 | v95.91,9.96 95.91,9.55 91.85,5.49 62.18,5.49 v60.96,6.71 | v33.73,6.71 28.25,1.22 7.92,1.22 4.67,4.47 4.67,29.46 9.75,34.54 R6.P$2
  Bottom 0.203: v112.37,16.66 104.04,16.66 100.38,13.01 98.96,13.01 v95.91,9.96 | v33.73,6.71 v60.96,6.71
N$14
  Top 0.203: COL7.1 2.03,25.81 2.03,22.35 R7.P$1
N$15  (via drill 0.51)
  Top 0.203: v123.75,21.13 142.85,21.13 144.88,23.16 148.13,23.16 152.4,27.43 152.4,30.48 149.96,32.92 149.96,40.64 150.77,41.45 150.77,42.47 U8.13 | v81.28,11.99 80.67,11.99 74.57,5.89 62.99,5.89 v62.18,6.71 | v30.48,4.67 29.26,4.67 26.21,1.63 12.6,1.63 11.79,2.44 11.79,15.44 9.75,17.48 9.75,22.15 R7.P$2
  Bottom 0.203: v123.75,21.13 122.94,21.95 121.51,21.95 117.86,18.29 95.3,18.29 94.89,18.69 87.99,18.69 v81.28,11.99 | v62.18,6.71 60.15,4.67 v30.48,4.67
N$16
  Top 0.203: COL8.1 2.03,13.82 2.03,10.16 R8.P$1
N$17  (via drill 0.51)
  Top 0.203: v91.24,11.79 94.08,14.63 105.46,14.63 106.07,14.02 106.07,11.99 107.09,10.97 113.18,10.97 113.79,11.58 113.79,13.82 111.56,16.05 111.56,17.07 111.96,17.48 118.26,17.48 119.69,16.05 143.87,16.05 152.81,24.99 152.81,37.19 150.98,39.01 150.98,40.03 U8.12 | v87.58,8.13 77.42,8.13 76.2,6.91 v76.2,6.3 | v64.82,6.71 64.01,6.71 v63.2,7.52
  Bottom 0.203: v87.58,8.13 v91.24,11.79 | v76.2,6.3 65.23,6.3 v64.82,6.71 | v63.2,7.52 32.11,7.52 28.65,4.06 28.65,2.85 26.21,0.41 8.74,0.41 6.71,2.44 6.71,6.91 9.75,9.96 R8.P$2
N$18
  Top 0.203: COL9.1 14.02,97.94 14.02,96.11 R9.P$1
N$19  (via drill 0.51)
  Top 0.203: v104.65,95.71 106.27,94.08 107.9,94.08 U1.19
  Bottom 0.203: v104.65,95.71 103.83,95.71 99.97,99.57 25.4,99.57 21.95,96.11 R9.P$2
N$20
  Top 0.203: COL10.1 14.02,85.95 14.02,83.72 R10.P$1
N$21  (via drill 0.51)
  Top 0.203: v86.97,93.07 90.22,93.07 90.83,92.46 100.38,92.46 101.4,91.44 107.9,91.44 U1.18 | v60.96,89.2 27.43,89.2 21.95,83.72 R10.P$2
  Bottom 0.203: v86.97,93.07 79.65,93.07 75.79,89.2 v60.96,89.2
N$22
  Top 0.203: COL11.1 14.02,73.97 14.02,71.53 R11.P$1
N$23  (via drill 0.51)
  Top 0.203: v62.99,79.65 59.54,76.2 v47.35,76.2
  Bottom 0.203: v62.99,79.65 83.92,79.65 87.58,83.31 87.58,83.92 96.11,92.46 103.02,92.46 106.48,89 107.9,89 U1.17 | v47.35,76.2 43.89,72.75 23.16,72.75 21.95,71.53 R11.P$2
N$24
  Top 0.203: COL12.1 14.02,61.98 14.02,59.33 R12.P$1
N$25
  Top 0.203: U1.16 107.9,86.36 106.68,86.36 103.23,89.81 97.13,89.81 96.52,89.2 92.25,89.2 90.83,90.63 76.4,90.63 76,91.03 64.41,91.03 62.38,93.07 61.16,93.07 60.76,92.66 60.76,90.63 61.77,89.61 61.77,88.8 60.15,87.17 47.35,87.17 26.01,65.84 26.01,64.21 21.95,60.15 21.95,59.33 R12.P$2
N$26
  Top 0.203: COL13.1 14.02,49.99 14.02,46.94 R13.P$1
N$27  (via drill 0.51)
  Top 0.203: v102.82,89 107.9,83.92 U1.15 | v101.6,90.63 100.79,90.63 100.38,90.22 96.93,90.22 96.32,89.61 92.46,89.61 90.22,91.85 82.5,91.85 78.84,95.5 75.59,95.5 74.78,94.69 29.67,94.69 15.85,80.87 15.85,52.83 21.74,46.94 R13.P$2
  Bottom 0.203: v102.82,89 102.82,89.41 v101.6,90.63
N$28
  Top 0.203: COL14.1 14.02,38 14.02,34.75 R14.P$1
N$29  (via drill 0.51)
  Top 0.203: v70.71,76.4 81.89,87.58 86.77,87.58 94.28,80.06 106.88,80.06 107.9,81.08 U1.14 | v15.04,66.24 15.04,62.59 15.44,62.18 15.44,42.27 21.74,35.97 21.74,34.75 R14.P$2
  Bottom 0.203: v70.71,76.4 58.52,76.4 49.58,67.46 16.26,67.46 v15.04,66.24
N$30
  Top 0.203: COL15.1 14.02,25.81 14.02,22.35 R15.P$1
N$31  (via drill 0.51)
  Top 0.203: v83.52,85.14 85.55,87.17 86.56,87.17 94.08,79.65 106.68,79.65 107.49,78.84 107.9,78.84 U1.13 | v65.84,80.47 58.93,73.56 v53.85,73.56 | v13.82,66.24 13.82,64.82 9.55,60.55 9.35,60.55 8.53,59.74 8.53,37.8 16.66,29.67 16.66,25.2 19.51,22.35 21.74,22.35 R15.P$2
  Bottom 0.203: v83.52,85.14 83.52,83.52 80.47,80.47 v65.84,80.47 | v53.85,73.56 53.85,73.15 49.78,69.09 16.66,69.09 v13.82,66.24
N$32
  Top 0.203: COL16.1 14.02,13.82 14.02,10.16 R16.P$1
N$33  (via drill 0.51)
  Top 0.203: v89.41,76.4 90.22,77.22 105.46,77.22 106.48,76.2 107.9,76.2 U1.12 | v30.68,68.28 23.16,60.76 23.16,58.73 21.74,57.3 v17.07,57.3
  Bottom 0.203: v89.41,76.4 73.15,76.4 72.34,77.22 58.73,77.22 49.78,68.28 v30.68,68.28 | v17.07,57.3 17.07,56.08 16.66,55.68 16.66,51.82 20.52,47.95 20.52,11.38 21.74,10.16 R16.P$2
N$34
  Top 0.203: COL17.1 26.01,97.94 26.01,96.11 R17.P$1
N$35  (via drill 0.51)
  Top 0.203: v103.63,94.89 101.19,94.89 100.79,95.3 97.94,95.3 96.11,93.47 92.25,93.47 91.24,94.49 v90.83,94.49 | v79.86,91.44 64.62,91.44 62.59,93.47 37.19,93.47 v36.78,93.07
  Bottom 0.203: v103.63,94.89 114.61,94.89 115.42,94.08 121.92,94.08 U2.19 | v90.83,94.49 90.22,94.49 87.17,91.44 v79.86,91.44 | v36.78,93.07 33.93,95.91 R17.P$2
N$36
  Top 0.203: COL18.1 26.01,85.95 26.01,83.72 R18.P$1
N$37  (via drill 0.51)
  Top 0.203: v116.03,92.86 116.03,93.47 114.2,95.3 111.15,95.3 108.92,97.54 99.16,97.54 96.32,94.69 96.32,94.28 95.91,93.88 92.86,93.88 91.44,95.3 v89.2,95.3
  Bottom 0.203: v116.03,92.86 117.65,92.86 119.08,91.44 121.92,91.44 U2.18 | v89.2,95.3 87.38,95.3 85.95,93.88 78.03,93.88 76.4,95.5 75.59,95.5 74.78,94.69 72.95,94.69 69.7,97.94 69.29,97.94 68.07,99.16 55.27,99.16 43.28,87.17 37.39,87.17 33.93,83.72 R18.P$2
N$38
  Top 0.203: COL19.1 26.01,73.97 26.01,71.53 R19.P$1
N$39  (via drill 0.51)
  Top 0.203: v53.44,85.14 44.5,76.2 38.61,76.2 33.93,71.53 R19.P$2
  Bottom 0.203: v53.44,85.14 58.12,85.14 61.77,88.8 76,88.8 79.45,92.25 87.38,92.25 92.86,97.74 100.58,97.74 101.19,97.13 101.19,95.5 106.48,90.22 108.31,90.22 108.71,90.63 111.56,90.63 111.96,90.22 114.4,90.22 115.01,90.83 118.47,90.83 120.29,89 121.92,89 U2.17
N$40
  Top 0.203: COL20.1 26.01,61.98 26.01,59.33 R20.P$1
N$41  (via drill 0.51)
  Top 0.203: v123.75,87.17 122.94,86.36 122.12,86.36 U2.16 | v78.44,94.69 77.22,94.69 76.4,93.88 30.68,93.88 21.95,85.14 21.34,85.14 20.52,84.33 20.52,70.51 v25.2,65.84
  Bottom 0.203: v123.75,87.17 124.36,87.78 124.36,88.8 122.94,90.22 119.69,90.22 117.86,92.05 114.81,92.05 114,92.86 106.27,92.86 105.05,94.08 103.23,94.08 101.6,95.71 101.6,97.33 99.77,99.16 82.91,99.16 v78.44,94.69 | v25.2,65.84 31.7,59.33 33.73,59.33 R20.P$2
N$42
  Top 0.203: COL21.1 26.01,49.99 26.01,46.94 R21.P$1
N$43  (via drill 0.51)
  Top 0.203: v130.66,73.36 129.44,74.57 129.03,74.57 128.02,75.59 128.02,79.45 123.75,83.72 122.12,83.72 U2.15 | v61.77,66.04 31.29,66.04 27.64,62.38 27.64,58.73 25.4,56.49 17.48,56.49 16.66,55.68 16.66,54.66 20.12,51.21 29.46,51.21 33.73,46.94 R21.P$2
  Bottom 0.203: v130.66,73.36 130.66,72.14 133.5,69.29 133.5,62.38 136.96,58.93 137.36,58.93 137.97,58.32 137.97,54.86 136.96,53.85 136.55,53.85 136.14,53.44 129.84,53.44 129.44,53.85 117.04,53.85 114,56.9 113.18,56.9 106.48,63.6 97.13,63.6 93.67,67.06 93.67,67.67 88.39,72.95 88.39,73.56 86.77,75.18 71.93,75.18 69.49,72.75 68.48,72.75 v61.77,66.04
N$44
  Top 0.203: COL22.1 26.01,34.75 R22.P$1
N$45  (via drill 0.51)
  Top 0.203: v92.66,85.14 v96.72,85.14 | v59.74,65.23 59.74,55.68 51.61,47.55 51.61,46.33 49.99,44.7 v49.58,44.7 | v41.25,33.33 35.15,33.33 33.93,34.54 R22.P$2
  Bottom 0.203: v96.72,85.14 100.79,85.14 101.19,84.73 108.51,84.73 110.54,82.7 114,82.7 115.42,81.28 121.92,81.28 U2.14 | v92.66,85.14 92.25,85.14 91.85,85.55 91.03,85.55 90.22,84.73 90.22,76 89.81,75.59 71.73,75.59 69.29,73.15 67.67,73.15 v59.74,65.23 | v49.58,44.7 49.58,39.22 47.14,36.78 47.14,34.14 46.33,33.33 v41.25,33.33
N$46
  Top 0.203: COL23.1 26.01,25.81 26.01,22.35 R23.P$1
N$47  (via drill 0.51)
  Top 0.203: v124.97,71.32 124.97,72.75 123.95,73.76 123.95,75.59 122.12,77.42 122.12,78.64 U2.13 | v118.87,66.24 118.47,66.24 118.06,66.65 106.48,66.65 105.66,65.84 104.85,65.84 102.82,67.87 102.82,71.53 103.02,71.73 103.02,72.54 100.99,74.57 99.16,74.57 97.33,76.4 96.52,76.4 86.97,66.85 86.97,66.24 79.05,58.32 v79.05,56.08 | v61.57,55.88 60.55,55.88 52.02,47.35 52.02,45.92 49.38,43.28 v48.77,43.28
  Bottom 0.203: v124.97,71.32 124.97,70.71 120.5,66.24 v118.87,66.24 | v79.05,56.08 65.43,56.08 65.02,55.68 61.77,55.68 v61.57,55.88 | v48.77,43.28 47.14,41.66 47.14,40.44 35.76,29.06 35.76,21.74 30.89,16.87 29.46,16.87 28.65,17.68 28.65,18.69 32.11,22.15 33.73,22.15 R23.P$2
N$48
  Top 0.203: COL24.1 26.01,13.82 26.01,10.16 R24.P$1
N$49  (via drill 0.51)
  Top 0.203: v123.95,72.34 123.95,73.15 122.12,74.98 122.12,76 U2.12 | v102.21,72.14 97.54,72.14 v92.46,67.06 | v85.75,67.06 84.33,67.06 v82.5,65.23 | v57.3,63.4 57.3,62.18 44.5,49.38 44.5,46.33 v48.77,42.06 | v45.72,36.37 44.5,35.15 44.5,33.33 47.35,30.48 47.35,21.74 40.84,15.24 37.59,15.24 33.93,11.58 33.93,10.16 R24.P$2
  Bottom 0.203: v123.95,72.34 122.94,72.34 122.73,72.14 120.29,72.14 118.26,70.1 118.26,68.68 117.45,67.87 114.2,67.87 109.93,72.14 v102.21,72.14 | v85.75,67.06 v92.46,67.06 | v82.5,65.23 80.67,65.23 80.26,65.63 62.59,65.63 60.35,63.4 v57.3,63.4 | v48.77,42.06 48.77,39.42 v45.72,36.37
N$50
  Top 0.203: COL25.1 38,97.94 38,96.11 R25.P$1
N$51  (via drill 0.51)
  Top 0.203: v133.71,93.88 129.64,89.81 124.97,89.81 v123.55,88.39 | v95.91,90.42 92.25,90.42 90.42,92.25 84.73,92.25 82.3,94.69 80.26,94.69 v76.61,98.35 | v69.7,98.75 62.99,98.75 62.59,99.16 48.97,99.16 45.92,96.11 R25.P$2
  Bottom 0.203: v133.71,93.88 136.96,93.88 U3.19 | v123.55,88.39 123.14,88.39 122.53,87.78 109.12,87.78 108.71,87.38 101.8,87.38 101.6,87.17 100.58,87.17 99.97,87.78 98.55,87.78 v95.91,90.42 | v76.61,98.35 75.39,98.35 74.57,99.16 70.1,99.16 v69.7,98.75
N$52
  Top 0.203: COL26.1 38,85.95 38,83.72 R26.P$1
N$53  (via drill 0.51)
  Top 0.203: v101.8,99.16 79.25,99.16 78.84,99.57 71.73,99.57 69.9,97.74 v68.28,97.74
  Bottom 0.203: v101.8,99.16 113.18,99.16 117.45,94.89 129.44,94.89 130.05,94.28 130.05,93.88 132.49,91.44 136.96,91.44 U3.18 | v68.28,97.74 57.71,87.17 49.38,87.17 45.92,83.72 R26.P$2
N$54
  Top 0.203: COL27.1 38,73.97 38,71.53 R27.P$1
N$55  (via drill 0.51)
  Top 0.203: v138.38,93.88 138.38,91.24 137.16,90.02 137.16,89 U3.17 | v130.45,96.93 129.03,98.35 102.82,98.35 102.41,97.94 98.75,97.94 v95.5,94.69
  Bottom 0.203: v138.38,93.88 136.96,95.3 132.08,95.3 v130.45,96.93 | v95.5,94.69 95.5,92.46 91.03,87.99 68.89,87.99 56.08,75.18 49.58,75.18 45.92,71.53 R27.P$2
N$56
  Top 0.203: COL28.1 38,61.98 38,59.33 R28.P$1
N$57  (via drill 0.51)
  Top 0.203: v139.4,79.65 139.4,82.7 137.16,84.94 137.16,86.16 U3.16 | v140.41,77.22 142.65,74.98 145.9,74.98 v146.51,75.59 | v154.03,43.28 154.03,25.4 155.45,23.98 155.45,11.58 144.27,0.41 104.65,0.41 v103.02,2.03 | v62.38,2.23 62.38,2.85 54.05,11.18 v54.05,17.88 | v56.08,53.44 56.08,59.74 58.93,62.59 58.93,65.23 58.52,65.63 52.02,65.63 45.72,59.33 R28.P$2
  Bottom 0.203: v139.4,79.65 139.4,78.23 v140.41,77.22 | v146.51,75.59 146.51,74.57 151.99,69.09 151.99,65.63 152.6,65.02 152.6,44.7 v154.03,43.28 | v103.02,2.03 100.58,4.47 64.62,4.47 v62.38,2.23 | v54.05,17.88 54.66,17.88 57.71,20.93 58.32,20.93 59.13,21.74 59.13,31.29 56.49,33.93 56.49,38.81 58.52,40.84 58.52,44.3 56.49,46.33 56.49,47.35 56.9,47.75 56.9,52.63 v56.08,53.44
N$58
  Top 0.203: COL29.1 38,49.99 38,46.94 R29.P$1
N$59  (via drill 0.51)
  Top 0.203: v131.47,77.83 v133.5,79.86 | v98.55,78.64 94.49,78.64 90.83,82.3 85.14,82.3 82.3,85.14 80.67,85.14 v71.93,76.4 | v58.12,64.82 58.12,62.38 45.92,50.19 45.92,46.94 R29.P$2
  Bottom 0.203: v133.5,79.86 136.96,83.31 136.96,83.72 U3.15 | v131.47,77.83 131.47,76.61 129.84,74.98 110.95,74.98 110.54,74.57 104.85,74.57 102.82,76.61 102.82,82.5 100.58,84.73 99.57,84.73 98.96,84.12 98.96,83.31 99.97,82.3 100.38,82.3 101.19,81.48 101.19,80.87 99.97,79.65 99.57,79.65 v98.55,78.64 | v71.93,76.4 69.09,73.56 66.85,73.56 v58.12,64.82
N$60
  Top 0.203: COL30.1 38,34.75 R30.P$1
N$61  (via drill 0.51)
  Top 0.203: v138.18,79.45 137.16,80.47 137.16,81.08 U3.14 | v142.24,68.89 v139.4,68.89 | v144.88,57.3 144.88,34.14 v144.07,33.33 | v139.4,24.59 122.94,24.59 v122.12,23.77 | v119.48,21.13 107.9,21.13 107.09,20.32 98.75,20.32 94.49,16.05 82.7,16.05 74.17,7.52 v70.51,7.52 | v58.12,20.12 55.27,22.96 55.27,25.6 46.33,34.54 45.92,34.54 R30.P$2
  Bottom 0.203: v138.18,79.45 138.18,78.44 136.96,77.22 135.94,77.22 134.93,76.2 133.71,76.2 133.3,75.79 133.3,74.98 v139.4,68.89 | v142.24,68.89 142.24,67.87 144.88,65.23 v144.88,57.3 | v144.07,33.33 141.22,30.48 141.22,29.67 141.63,29.26 141.63,26.82 v139.4,24.59 | v119.48,21.13 v122.12,23.77 | v70.51,7.52 64.41,13.61 64.41,14.43 58.73,20.12 v58.12,20.12
N$62
  Top 0.203: COL31.1 38,25.81 38,22.15 R31.P$1
N$63  (via drill 0.51)
  Top 0.203: v144.27,85.14 144.27,87.99 144.47,88.19 144.47,96.93 141.83,99.57 103.43,99.57 102.21,98.35 91.03,98.35 87.58,94.89 v87.58,94.28 | v76,94.69 75.39,94.69 74.98,94.28 30.48,94.28 27.84,91.64 27.23,91.64 16.26,80.67 16.26,54.25 28.65,41.86 28.65,25.2 29.46,24.38 34.75,24.38 37.59,27.23 38.81,27.23 43.89,22.15 45.72,22.15 R31.P$2
  Bottom 0.203: v144.27,85.14 141.83,85.14 139.4,82.7 136.96,82.7 134.31,80.06 134.31,77.83 134.72,77.42 135.53,77.42 135.74,77.62 135.94,77.62 136.96,78.64 U3.13 | v87.58,94.28 86.97,94.28 86.16,93.47 77.22,93.47 v76,94.69
N$64
  Top 0.203: COL32.1 38,13.82 38,10.16 R32.P$1
N$65  (via drill 0.51)
  Top 0.203: v130.45,76.81 131.67,76.81 135.53,80.67 135.53,96.52 136.55,97.54 137.36,97.54 140.21,94.69 140.21,79.25 137.16,76.2 U3.12 | v105.66,75.79 105.26,75.79 104.44,74.98 99.36,74.98 97.54,76.81 96.32,76.81 86.56,67.06 86.56,66.65 82.3,62.38 v79.05,62.38 | v64.62,56.49 62.18,54.05 59.94,54.05 56.9,51 56.9,47.75 v55.27,46.13 | v48.56,29.06 48.56,14.83 45.92,12.19 45.92,10.16 R32.P$2
  Bottom 0.203: v130.45,76.81 129.84,76.81 129.03,77.62 113.59,77.62 113.18,77.22 107.09,77.22 v105.66,75.79 | v79.05,62.38 76,62.38 74.17,60.55 68.68,60.55 v64.62,56.49 | v55.27,46.13 55.27,43.89 56.49,42.67 56.49,41.25 54.05,38.81 54.05,34.54 v48.56,29.06
N$66
  Top 0.203: COL33.1 50.19,97.94 50.19,96.11 R33.P$1
N$67  (via drill 0.51)
  Top 0.203: v141.43,54.46 141.43,60.76 142.24,61.57 144.47,61.57 150.37,67.46 151.59,67.46 153.62,69.49 153.62,73.15 156.46,76 156.46,79.86 156.26,80.06 156.06,80.06 153.82,82.3 153.82,90.02 150.98,92.86 150.98,93.88 U4.19 | v133.91,55.68 v133.91,46.94 | v112.57,65.84 112.17,65.84 111.76,66.24 106.68,66.24 105.87,65.43 103.43,65.43 v97.74,71.12 | v92.66,78.44 84.12,78.44 v79.65,82.91 | v75.39,87.17 67.67,87.17 62.59,92.25 v61.57,92.25
  Bottom 0.203: v141.43,54.46 141.43,53.85 140.21,52.63 140.21,45.72 139.8,45.31 138.38,45.31 136.96,46.74 134.11,46.74 v133.91,46.94 | v133.91,55.68 133.3,55.68 129.64,59.33 119.08,59.33 v112.57,65.84 | v97.74,71.12 97.74,71.73 92.66,76.81 v92.66,78.44 | v75.39,87.17 v79.65,82.91 | v61.57,92.25 57.91,95.91 R33.P$2
N$68
  Top 0.203: COL34.1 50.19,85.95 R34.P$1
N$69  (via drill 0.51)
  Top 0.203: v149.96,82.7 151.38,82.7 151.99,83.31 151.99,84.12 151.38,84.73 150.98,84.73 149.96,85.75 149.96,89.2 150.77,90.02 150.77,91.24 U4.18 | v134.11,75.39 130.05,71.32 v128.63,71.32 | v121.31,65.02 111.76,65.02 v111.35,65.43 | v61.77,79.65 57.91,83.52 R34.P$2
  Bottom 0.203: v149.96,82.7 143.05,82.7 141.22,80.87 141.22,76.81 139.4,74.98 134.52,74.98 v134.11,75.39 | v128.63,71.32 128.63,70.92 124.36,66.65 122.94,66.65 v121.31,65.02 | v111.35,65.43 108.92,67.87 103.43,67.87 96.11,75.18 96.11,78.23 97.94,80.06 97.94,82.7 94.69,85.95 90.83,85.95 88.39,83.52 88.39,82.91 83.11,77.62 63.8,77.62 v61.77,79.65
N$70
  Top 0.203: COL35.1 50.19,73.97 50.19,71.53 R35.P$1
N$71  (via drill 0.51)
  Top 0.203: v152.4,70.1 152.4,86.36 150.98,87.78 150.98,88.8 U4.17 | v146.71,25.6 143.05,21.95 121.92,21.95 120.7,23.16 97.13,23.16 94.89,20.93 93.27,20.93 91.85,22.35 91.85,33.73 82.7,42.88 80.26,42.88 77.62,45.52 77.62,49.38 62.59,64.41 62.59,66.65 57.91,71.32 R35.P$2
  Bottom 0.203: v152.4,70.1 152.4,65.84 153.01,65.23 153.01,45.52 154.84,43.69 154.84,41.45 151.99,38.61 150.57,38.61 149.56,37.59 149.56,31.5 146.71,28.65 v146.71,25.6
N$72
  Top 0.203: COL36.1 50.19,61.98 50.19,59.33 R36.P$1
N$73  (via drill 0.51)
  Top 0.203: v135.13,78.23 135.13,75.18 130.25,70.31 v129.64,70.31 | v124.36,65.84 123.34,64.82 123.34,64.62 122.94,64.21 v112.57,64.21 | v110.13,65.43 106.48,65.43 106.07,65.02 98.15,65.02 97.94,65.23 94.28,65.23 v81.08,52.02
  Bottom 0.203: v135.13,78.23 136.55,79.65 136.96,79.65 142.04,84.73 143.46,84.73 144.27,83.92 146.3,83.92 148.54,86.16 150.77,86.16 U4.16 | v129.64,70.31 128.83,70.31 v124.36,65.84 | v112.57,64.21 111.35,64.21 v110.13,65.43 | v81.08,52.02 62.79,52.02 57.91,56.9 57.91,59.13 R36.P$2
N$74
  Top 0.203: COL37.1 50.19,49.99 50.19,46.94 R37.P$1
N$75  (via drill 0.51)
  Top 0.203: v150.16,92.66 149.56,92.05 149.56,85.55 150.77,84.33 150.77,83.92 U4.15 | v138.18,17.68 137.36,16.87 v128.22,16.87 | v123.14,22.96 121.51,22.96 120.9,23.57 v96.32,23.57 | v90.02,21.95 87.78,21.95 82.7,16.87 74.57,16.87 73.76,16.05 v72.95,16.05
  Bottom 0.203: v150.16,92.66 151.18,92.66 155.85,97.33 155.85,98.15 156.06,98.35 158.29,98.35 159.51,97.13 159.51,30.89 146.3,17.68 v138.18,17.68 | v128.22,16.87 128.22,17.88 v123.14,22.96 | v96.32,23.57 91.64,23.57 v90.02,21.95 | v72.95,16.05 70.31,16.05 64.01,22.35 64.01,30.89 60.15,34.75 60.15,44.5 57.91,46.74 R37.P$2
N$76
  Top 0.203: COL38.1 50.19,38 50.19,34.75 R38.P$1
N$77  (via drill 0.51)
  Top 0.203: v119.69,17.68 v136.96,17.68 | v103.63,10.16 v106.48,10.16 | v98.55,10.16 96.93,10.16 96.32,10.77 95.5,10.77 95.1,10.36 95.1,9.35 92.86,7.11 v77.62,7.11
  Bottom 0.203: v136.96,17.68 137.77,18.49 146.51,18.49 156.06,28.04 156.06,49.38 154.23,51.21 154.23,77.42 150.98,80.67 150.98,81.08 U4.14 | v119.69,17.68 116.23,14.22 116.23,11.58 114.81,10.16 v106.48,10.16 | v98.55,10.16 v103.63,10.16 | v77.62,7.11 74.98,7.11 59.54,22.55 59.54,32.92 57.91,34.54 R38.P$2
N$78
  Top 0.203: COL39.1 50.19,25.81 50.19,22.35 R39.P$1
N$79  (via drill 0.51)
  Top 0.203: v148.13,74.17 147.52,74.17 144.47,71.12 137.97,71.12 v136.35,69.49 | v103.63,78.03 100.99,78.03 100.58,77.62 89.41,77.62 88.39,76.61 88.39,71.73 82.7,66.04 81.08,66.04 v79.86,64.82 | v63.4,56.49 61.37,54.46 59.74,54.46 56.08,50.8 v56.08,48.16
  Bottom 0.203: v148.13,74.17 148.13,75.39 150.77,78.03 150.77,78.64 U4.13 | v136.35,69.49 136.35,70.1 132.28,74.17 132.28,78.23 130.86,79.65 128.02,79.65 126.8,78.44 124.36,78.44 122.73,80.06 111.76,80.06 111.15,80.67 110.34,80.67 109.32,79.65 105.26,79.65 v103.63,78.03 | v79.86,64.82 79.05,64.82 78.64,65.23 72.14,65.23 v63.4,56.49 | v56.08,48.16 56.08,43.89 58.12,41.86 58.12,41.05 56.08,39.01 56.08,23.98 57.71,22.35 R39.P$2
N$80
  Top 0.203: COL40.1 50.19,13.82 50.19,10.16 R40.P$1
N$81  (via drill 0.51)
  Top 0.203: v143.05,62.38 141.83,63.6 141.83,65.43 142.85,66.45 148.13,66.45 150.16,68.48 150.16,69.49 149.96,69.7 149.96,73.97 150.77,74.78 150.77,76 U4.12 | v144.07,56.29 144.07,34.54 143.26,33.73 143.26,32.72 146.71,29.26 146.71,26.82 145.69,25.81 141.02,25.81 140.61,26.21 123.95,26.21 122.33,24.59 v120.9,24.59 | v76.81,21.74 76.2,21.74 69.7,15.24 61.57,15.24 v59.94,13.61
  Bottom 0.203: v143.05,62.38 144.07,61.37 v144.07,56.29 | v120.9,24.59 103.43,24.59 101.8,26.21 92.46,26.21 87.17,20.93 77.62,20.93 v76.81,21.74 | v59.94,13.61 59.94,12.19 57.91,10.16 R40.P$2
N$82
  Top 0.203: COL41.1 62.18,97.94 62.18,96.11 R41.P$1
N$83  (via drill 0.51)
  Top 0.203: v87.58,73.15 87.58,74.17 80.47,81.28 v80.06,81.28 | v76.2,85.14 76.2,89.61 v75.59,90.22
  Bottom 0.203: v87.58,73.15 93.27,67.46 93.27,63.2 97.94,58.52 98.75,58.52 99.16,58.93 104.04,58.93 105.05,57.91 107.9,57.91 U5.19 | v76.2,85.14 v80.06,81.28 | v75.59,90.22 69.9,95.91 R41.P$2
N$84
  Top 0.203: COL42.1 62.18,85.95 R42.P$1
N$85  (via drill 0.51)
  Top 0.203: v78.23,64.41 78.23,65.43 69.9,73.76 69.9,83.52 R42.P$2
  Bottom 0.203: v78.23,64.41 78.44,64.41 89.41,53.44 93.88,53.44 94.28,53.85 99.97,53.85 100.99,54.86 102.82,54.86 103.23,55.27 107.9,55.27 U5.18
N$86
  Top 0.203: COL43.1 62.18,73.97 62.18,71.53 R43.P$1
N$87  (via drill 0.51)
  Top 0.203: v109.12,48.77 109.12,50.6 108.1,51.61 108.1,52.63 U5.17 | v90.83,54.25 v96.32,48.77
  Bottom 0.203: v96.32,48.77 v109.12,48.77 | v90.83,54.25 90.83,58.93 79.65,70.1 71.12,70.1 69.9,71.32 R43.P$2
N$88
  Top 0.203: COL44.1 62.18,61.98 62.18,59.33 R44.P$1
N$89
  Bottom 0.203: U5.16 107.9,50.39 106.88,50.39 105.87,51.41 86.77,51.41 80.47,57.71 71.32,57.71 69.9,59.13 R44.P$2
N$90
  Top 0.203: COL45.1 62.18,49.99 62.18,46.94 R45.P$1
N$91  (via drill 0.51)
  Top 0.203: v103.83,47.55 100.38,44.09 81.48,44.09 v81.08,44.5
  Bottom 0.203: v103.83,47.55 107.9,47.55 U5.15 | v81.08,44.5 72.95,44.5 70.71,46.74 69.9,46.74 R45.P$2
N$92
  Top 0.203: COL46.1 62.18,38 62.18,34.75 R46.P$1
N$93
  Bottom 0.203: U5.14 107.9,45.11 101.4,45.11 99.97,43.69 93.27,43.69 85.55,35.97 71.12,35.97 69.9,34.75 R46.P$2
N$94
  Top 0.203: COL47.1 62.18,25.81 62.18,22.35 R47.P$1
N$95  (via drill 0.51)
  Top 0.203: v83.72,29.87 74.78,20.93 71.12,20.93 69.9,22.15 R47.P$2
  Bottom 0.203: v83.72,29.87 95.5,41.66 100.58,41.66 100.99,42.06 106.48,42.06 106.88,42.47 107.9,42.47 U5.13
N$96
  Top 0.203: COL48.1 62.18,13.82 62.18,10.16 R48.P$1
N$97  (via drill 0.51)
  Top 0.203: v91.03,29.87 86.36,29.87 73.76,17.27 72.34,17.27 69.9,14.83 69.9,10.16 R48.P$2
  Bottom 0.203: v91.03,29.87 95.1,33.93 95.1,34.75 99.36,39.01 106.07,39.01 107.09,40.03 107.9,40.03 U5.12
N$98
  Top 0.203: COL49.1 74.17,97.94 74.17,96.11 R49.P$1
N$99  (via drill 0.51)
  Top 0.203: v121.92,33.53 120.5,34.95 120.5,55.47 121.92,56.9 121.92,57.71 U6.19 | v124.36,31.09 123.75,31.09 121.72,29.06 121.72,26.62 119.69,24.59 100.99,24.59 96.32,29.26 96.32,35.15 v88.59,42.88 | v77.42,56.9 77.42,65.63 68.28,74.78 v68.28,82.91 | v63.6,90.02 v68.28,85.34 | v68.07,96.11 69.29,97.33 71.73,97.33 73.56,99.16 78.64,99.16 81.69,96.11 R49.P$2
  Bottom 0.203: v124.36,31.09 v121.92,33.53 | v88.59,42.88 88.59,48.97 80.67,56.9 v77.42,56.9 | v68.28,85.34 v68.28,82.91 | v63.6,90.02 63.6,91.64 v68.07,96.11
N$100